# Altium schematic sheet Sheet_4.schdoc
size 200 x 172 mm
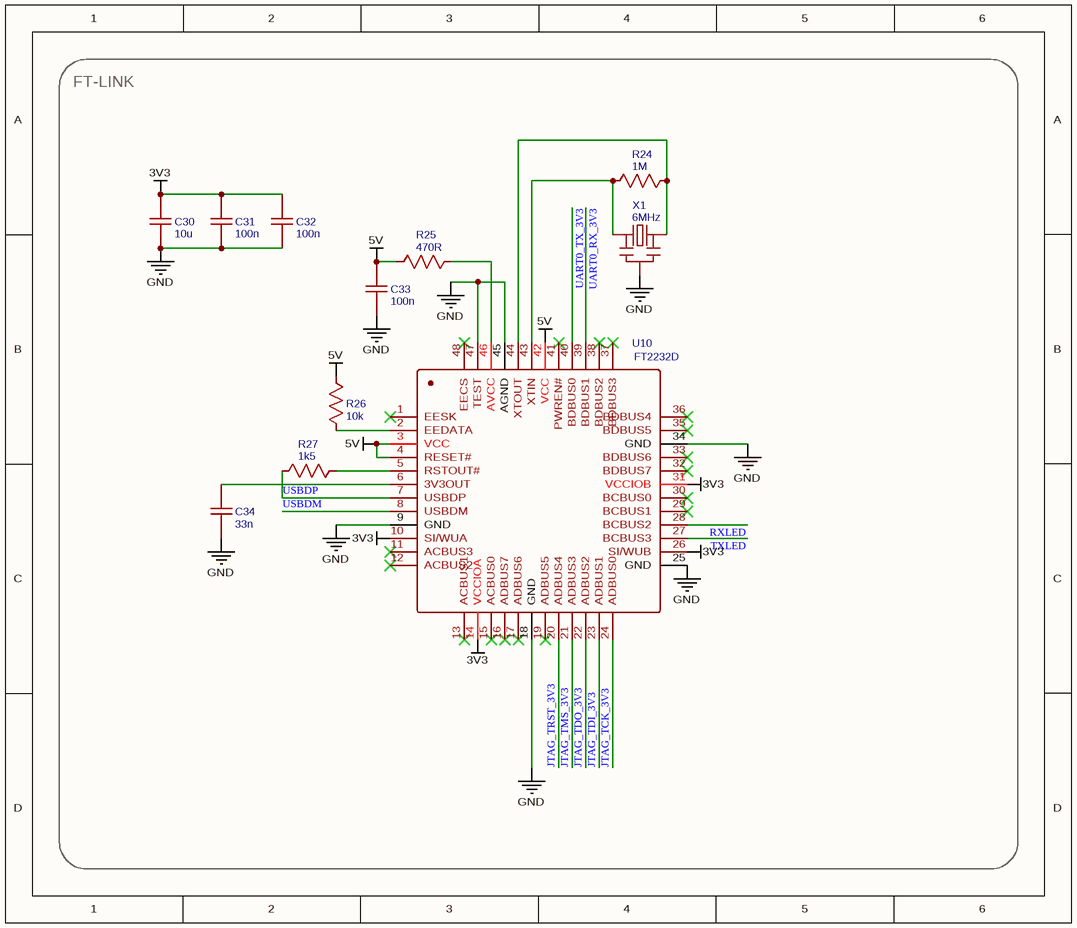
[diagram p0: Sheet_4.schdoc]

## Parts
C30  10u  [CAPA-0603]
C31  100n  [CAPA-0402]
C32  100n  [CAPA-0402]
C33  100n  [CAPA-0402]
C34  33n  [CAPA-0603]
R24  1M  [RES-0402]
R25  470R  [RES-0402]
R26  10k  [RES-0402]
R27  1k5  [RES-0402]
U10  FT2232D  [LQFP-48_L7.0-W7.0-P0.50-LS9.0-BL]
X1  6MHz  [CRYSTAL-SMD_3P-L4.5-W2.0-L]

## Blocks framed on the sheet
FT-LINK: C30-C34 R24-R27 U10 X1

## Nets
3V3: C30.2 C31.2 C32.2 U10.10(SI/WUA) U10.14(VCCIOA) U10.26(SI/WUB) U10.31(VCCIOB)
5V: C33.2 R25.1 R26.1 U10.3(VCC) U10.4(RESET#) U10.42(VCC)
GND: C30.1 C31.1 C32.1 C33.1 C34.1 U10.9(GND) U10.18(GND) U10.25(GND) U10.34(GND) U10.45(AGND) U10.47(TEST) X1.2(GND)
JTAG_TCK_3V3: U10.24(ADBUS0)
JTAG_TDI_3V3: U10.23(ADBUS1)
JTAG_TDO_3V3: U10.22(ADBUS2)
JTAG_TMS_3V3: U10.21(ADBUS3)
JTAG_TRST_3V3: U10.20(ADBUS4)
RXLED: U10.28(BCBUS2)
TXLED: U10.27(BCBUS3)
UART0_RX_3V3: U10.39(BDBUS1)
UART0_TX_3V3: U10.40(BDBUS0)
USBDM: U10.8(USBDM)
USBDP: R27.1 U10.7(USBDP)
NetC34_2: C34.2 U10.6(3V3OUT)
NetR24_1: R24.1 U10.43(XTIN) X1.1(IN)
NetR24_2: R24.2 U10.44(XTOUT) X1.3(OUT)
NetR25_2: R25.2 U10.46(AVCC)
NetR26_2: R26.2 U10.2(EEDATA)
NetR27_2: R27.2 U10.5(RSTOUT#)

Not connected (* = marked no-connect by the designer): U10 1(EESK)* 11(ACBUS3)* 12(ACBUS2)* 13(ACBUS1)* 15(ACBUS0)* 16(ADBUS7)* 17(ADBUS6)* 19(ADBUS5)* 29(BCBUS1)* 30(BCBUS0)* 32(BDBUS7)* 33(BDBUS6)* 35(BDBUS5)* 36(BDBUS4)* 37(BDBUS3)* 38(BDBUS2)* 41(PWREN#)* 48(EECS)*

## Library data of the parts
C30 = 10u: BOM_Manufacturer Part: CL10A106KP8NNNC; BOM_Manufacturer: SAMSUNG; nameAlias: Value(F); BOM_Supplier Part: C19702; BOM_Supplier: LCSC; link: https://atta.szlcsc.com/upload/public/pdf/source/20160103/1457707703378.pdf; spicePre: C; spiceSymbolName: CAPA-0603_10u_10V
C31-C33 = 100n: BOM_Manufacturer Part: CL05B104KB54PNC; BOM_Manufacturer: SAMSUNG; nameAlias: Value(F); BOM_Supplier Part: C307331; BOM_Supplier: LCSC; link: https://atta.szlcsc.com//upload/public/pdf/source/20160103/1457707735223.pdf; spicePre: C; spiceSymbolName: CAPA-0402_100n
C34 = 33n: BOM_Manufacturer Part: CL10B333KB8NNNC; BOM_Manufacturer: SAMSUNG; nameAlias: Value(F); BOM_Supplier Part: C21117; BOM_Supplier: LCSC; link: https://atta.szlcsc.com//upload/public/pdf/source/20160103/1457707679526.pdf; spicePre: C; spiceSymbolName: CAPA-0603_33n
R24 = 1M: BOM_Manufacturer Part: 0402WGF1004TCE; BOM_Manufacturer: UniOhm 台湾厚声; nameAlias: Value(Ω); BOM_Supplier Part: C26083; BOM_Supplier: LCSC; link: https://atta.szlcsc.com//upload/public/pdf/source/20200306/C422600_1E6D84923E4A46A82E41ADD87F860B5C.pdf; spicePre: R; spiceSymbolName: RES-0402_1M
R25 = 470R: BOM_Manufacturer Part: 0402WGF4700TCE; BOM_Manufacturer: UniOhm 台湾厚声; nameAlias: Value(Ω); BOM_Supplier Part: C25117; BOM_Supplier: LCSC; link: https://atta.szlcsc.com//upload/public/pdf/source/20200306/C422600_1E6D84923E4A46A82E41ADD87F860B5C.pdf; spicePre: R; spiceSymbolName: RES-0402_470R
R26 = 10k: BOM_Manufacturer Part: 0402WGF1002TCE; BOM_Manufacturer: UniOhm 台湾厚声; nameAlias: Value(Ω); BOM_Supplier Part: C25744; BOM_Supplier: LCSC; link: https://atta.szlcsc.com//upload/public/pdf/source/20200306/C422600_1E6D84923E4A46A82E41ADD87F860B5C.pdf; spicePre: R; spiceSymbolName: RES-0402_10k
R27 = 1k5: BOM_Manufacturer Part: 0402WGF1501TCE; BOM_Manufacturer: UniOhm 台湾厚声; nameAlias: Value(Ω); BOM_Supplier Part: C25867; BOM_Supplier: LCSC; spicePre: R; spiceSymbolName: RES-0402_1k5
U10 = FT2232D: BOM_Manufacturer: FTDI; BOM_Supplier: LCSC; BOM_Supplier Part: C428116; BOM_Manufacturer Part: FT2232D; BOM_JLCPCB Part Class: Extended Part; link: http://www.ftdichip.com/Support/Documents/DataSheets/ICs/DS_FT2232D.pdf; spicePre: U; spiceSymbolName: FT2232D
X1 = 6MHz: BOM_Manufacturer: muRata(村田); BOM_Manufacturer Part: CSTCR6M00G53-R0; nameAlias: Frequency; BOM_Supplier: LCSC; BOM_Supplier Part: C85845; BOM_JLCPCB Part Class: Extended Part; link: https://www.mouser.com/datasheet/2/281/p16e-522700.pdf; spicePre: X; spiceSymbolName: CSTCR6M00G53-R0